# Altium project WR_NIC.PrjPcb (part 3 of 3)

## Sheet 18-Power-P3V3.SchDoc
size B; SheetNumber: 18; SheetTotal: 20; SPICEModelCacheMBQUAUON: <root> / <DocumentId>MBQUAUON</DocumentId> / <CacheFrame Number="0"> / <Model Name="emk105bj105_v-f" Kind="CKT"> / <Text>* EMK105BJ105_V-F     SPICE MODEL  ( General Type ) / *-------------------------------------------------------------------------------------------------------- / * Model Generated by TAIYO YUDEN Corporation (http://www.ty-top.com) / * Version 1.0 / * TAIYO YUDEN Control No. 170508_130520 / * Copyright(c) 2012 TAIYO YUDEN CO.,LTD. All Rights Reserved. / *-------------------------------------------------------------------------------------------------------- / * / * Products Name : Multilayer Ceramic Capacitors / * / * Characteristics : / *     Capacitance : 1 uF , Rated Voltage : 16V , TCC : X5R / *     Case Size : 1.0 x 0.5 / 0.039 x 0.02 [mm/inch] , Thickness : 0.5 / 0.02 [mm/inch] / *     (Conditions: Temperature = 25 degC , DC Bias Current/Voltage = 0A / 0V) / * / * Frequency Range : 40Hz - 3GHz / * / * External Node Assignments : / * / *  1  o---| |---o  2 / * / *-------------------------------------------------------------------------------------------------------- / .SubCkt EMK105BJ105_V-F 1 2 / **************************** / C0 1 110 0.68309u / Cm 1 101 0.26053u / C1 101 102 0.94076u / Rc1 101 102 1.9029k / C2 102 103 0.66707u / Rc2 102 103 120.36 / C3 103 110 0.57203u / Rc3 103 110 2.1097 / C2m 1 301 0.1871u / C21 301 302 3.2494u / Rc21 301 302 1.1117k / C22 302 303 2.1014u / Rc22 302 303 1.484k / C23 303 304 2.1172u / Rc23 303 304 1.3876k / C24 304 305 0.75729u / Rc24 304 305 332.59 / C25 305 306 0.94401u / Rc25 305 306 249.09 / C26 306 307 0.34674u / Rc26 306 307 28.352 / C27 307 308 0.37158u / Rc27 307 308 19.989 / C28 308 309 0.17933u / Rc28 308 309 31.748 / C29 309 110 0.016445u / Rc29 309 110 1.0592 / Rp0 1 110 100Meg / L0 110 120 0.2216n / Lm 120 130 0.1509n / L1 120 121 0.12659n / RL1 121 130 0.85161 / L2 120 122 0.15996n / RL2 122 130 0.42469 / L3 120 123 7.9543n / RL3 123 130 0.54643m / CR 120 124 0.24334u / LR 124 125 0.090738n / RR 125 130 68.076m / CL 130 140 2.7354p / LL 130 140 0.10762n / RL 130 140 50.614 / Rs 140 2 7.5416m / **************************** / .ends EMK105BJ105_V-F</Text> / </Model> / </CacheFrame> / </root>
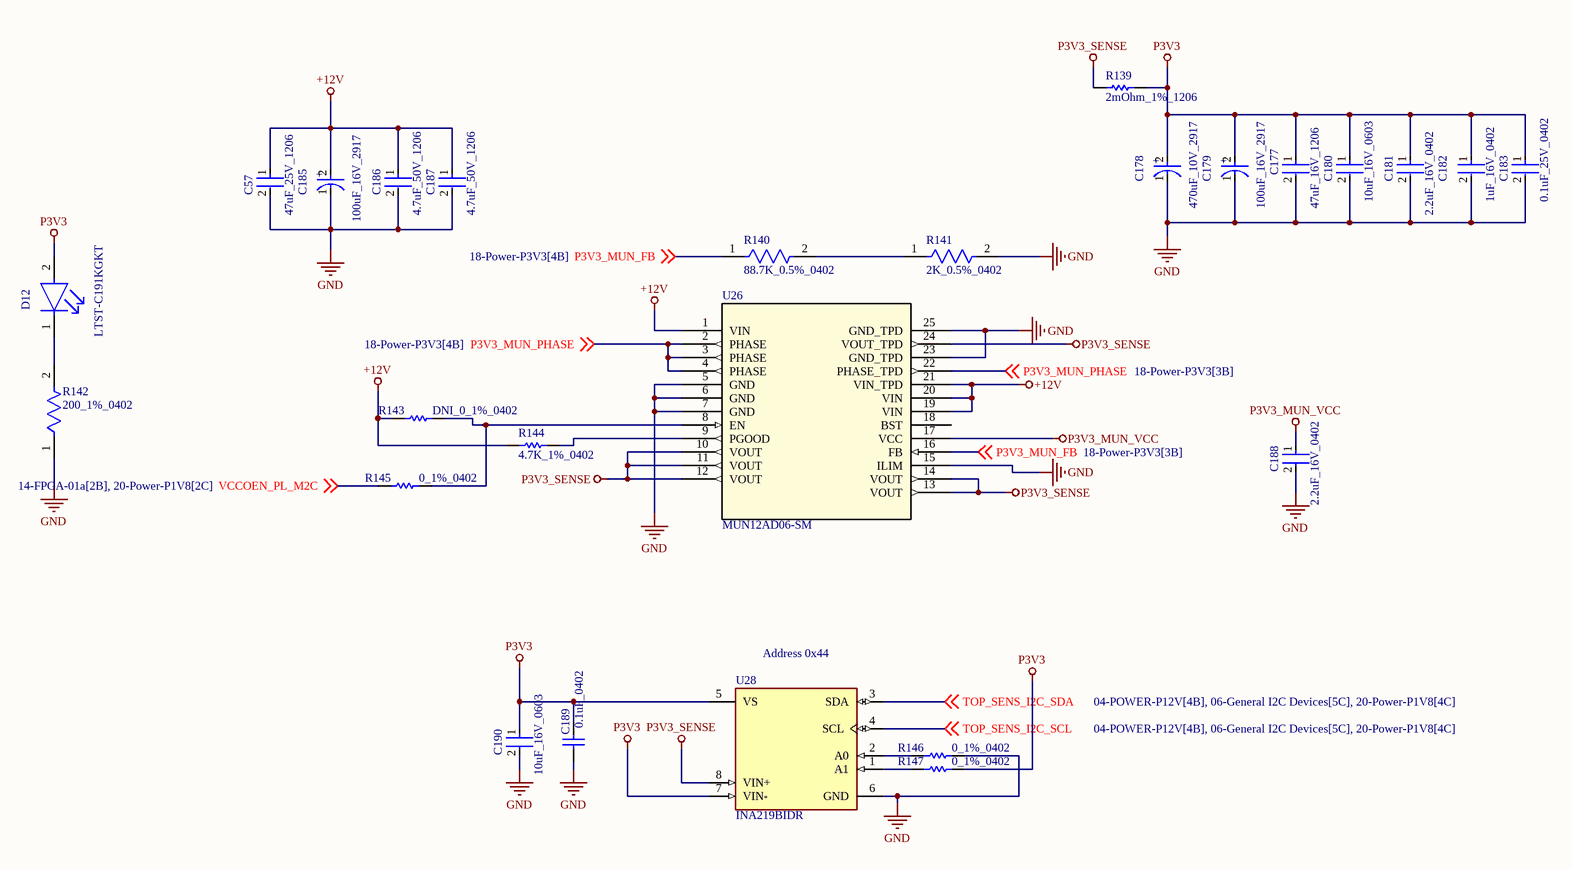
[diagram p9: 18-Power-P3V3.SchDoc]

### Parts
C57  47uF_25V_1206  [FP-C3216-160-0_2-MFG]
C177  47uF_16V_1206  [FP-C3216-160-0_2-MFG]
C178  470uF_10V_2917  [FP-TAJE-MFG]
C179  100uF_16V_2917  [FP-T495D107K016ATE125-MFG]
C180  10uF_16V_0603  [FP-0603-L_1_6_0_2-W_0_8_0-MFG]
C181  2.2uF_16V_0402  [FP-C1005-050-0_05-IPC_A]
C182  1uF_16V_0402  [FP-0402-L_1_0_0_05-W_0_5-IPC_A]
C183  0.1uF_25V_0402  [FP-0402-L_1_0_1-W_0_5_0_1-IPC_C]
C185  100uF_16V_2917  [FP-T495D107K016ATE125-MFG]
C186  4.7uF_50V_1206  [FP-GRM31C-0_2-e0_3_0_8-IPC_C]
C187  4.7uF_50V_1206  [FP-GRM31C-0_2-e0_3_0_8-IPC_C]
C188  2.2uF_16V_0402  [FP-C1005-050-0_05-IPC_A]
C189  0.1uF_0402  [CAPC1005X56X25NL10T15]
C190  10uF_16V_0603  [FP-0603-L_1_6_0_2-W_0_8_0-MFG]
D12  LTST-C191KGKT  [FP-LTST-C191KGKT-MFG]
R139  2mOhm_1%_1206  [RESC3216X89X64NL25T25]
R140  88.7K_0.5%_0402  [FP-RT0402-MFG]
R141  2K_0.5%_0402  [FP-RR0510-IPC_B]
R142  200_1%_0402  [FP-ERJ2RK-IPC_A]
R143  DNI_0_1%_0402  [RESC1005X40X25LL05T05]  (no BOM)
R144  4.7K_1%_0402  [RESC1005X40X25NL10T10]
R145  0_1%_0402  [RESC1005X40X25LL05T05]
R146  0_1%_0402  [RESC1005X40X25LL05T05]
R147  0_1%_0402  [RESC1005X40X25LL05T05]
U26  MUN12AD06-SM  [MUN12AD06-SM_CYN]
U28  INA219BIDR  [FP-D0008A-MFG]

### Nets
+12V: C57.1 C185.2(A) C186.1 C187.1 R143.1 R144.2 U26.1(VIN) U26.19(VIN) U26.20(VIN) U26.21(VIN_TPD)
GND: C57.2 C177.2 C178.1(C) C179.1(C) C180.2 C181.2 C182.2 C183.2 C185.1(C) C186.2 C187.2 C188.2 C189.1 C190.2 R141.2 R142.1 R146.2 U26.5(GND) U26.6(GND) U26.7(GND) U26.15(ILIM) U26.23(GND_TPD) U26.25(GND_TPD) U28.6(GND)
P3V3: C177.1 C178.2(A) C179.2(A) C180.1 C181.1 C182.1 C183.1 C189.2 C190.1 D12.2(A) R139.2 R147.2 U28.5(VS) U28.7(VIN-)
P3V3_MUN_VCC: C188.1 U26.17(VCC)
P3V3_SENSE: R139.1 U26.10(VOUT) U26.11(VOUT) U26.12(VOUT) U26.13(VOUT) U26.14(VOUT) U26.24(VOUT_TPD) U28.8(VIN+)
P3V3_MUN_FB: R140.1 U26.16(FB) ; off-sheet P3V3_MUN_FB
P3V3_MUN_PHASE: U26.2(PHASE) U26.3(PHASE) U26.4(PHASE) U26.22(PHASE_TPD) ; off-sheet P3V3_MUN_PHASE
TOP_SENS_I2C_SCL: U28.4(SCL) ; off-sheet TOP_SENS_I2C_SCL
TOP_SENS_I2C_SDA: U28.3(SDA) ; off-sheet TOP_SENS_I2C_SDA
VCCOEN_PL_M2C: R145.1 ; off-sheet VCCOEN_PL_M2C
NetD12_1: D12.1(C) R142.2
NetR140_2: R140.2 R141.1
NetR143_2: R143.2 R145.2 U26.8(EN)
NetR144_1: R144.1 U26.9(PGOOD)
NetR146_1: R146.1 U28.2(A0)
NetR147_1: R147.1 U28.1(A1)

Not connected (* = marked no-connect by the designer): U26 18(BST)

### Notes on the sheet
- (near U28) Address 0x44
- (in symbol CMP-2000-07207-2) +
- (in symbol CMP-04424-000243-1) +

### Library data of the parts
C57 = CMP-2000-05397-3: Multilayer Ceramic Capacitors 47uF ±20% 25V X5R SMD 1206; Weight: 0.000571oz; Dielectric: X5R; Length: 0.126inch; Voltage Rating: 25V; Case/Package: 1206; Dielectric Material: Ceramic; Min Operating Temperature: -55°C; Lead Free: Lead Free; Packaging: Tape and Reel; Package Quantity: 1; Mount: Surface Mount; Depth: 1.6mm; REACH SVHC: No SVHC; Termination: SMD/SMT; Case Code (Imperial): 1206; Series: C; Resistor Type: Ceramic; Voltage: 25V; Width: 0.063inch; Height: 1.6mm; Tolerance: 20%; Capacitance: 47uF; Max Operating Temperature: 85°C; Voltage Rating (DC): 25V; RoHS Compliant: Yes; Thickness: 0.071inch; Case Code (Metric): 3216
C177 = CMP-2000-07442-2: Multilayer Ceramic Capacitors 47uF ±20% 16V X5R SMD 1206; Resistor Type: Ceramic; Width: 0.063inch; Case Code (Imperial): 1206; Radiation Hardening: No; Thickness: 0.071inch; Dielectric: X5R; Weight: 0.000571oz; Termination: SMD/SMT; Dielectric Material: Ceramic; Min Operating Temperature: -55°C; Depth: 1.6mm; Case Code (Metric): 3216; Max Operating Temperature: 85°C; RoHS Compliant: Yes; REACH SVHC: No SVHC; Mount: Surface Mount; Lead Free: Lead Free; Height: 1.6mm; Length: 3.2mm; Tolerance: 20%; Voltage Rating (DC): 16V; Capacitance: 47uF; Package Quantity: 1; Construction: Flat; Packaging: Tape and Reel; Series: C; Case/Package: 1206; Voltage Rating: 16V
C178 = CMP-04424-000243-1: 470uF 10V  ±10% 500mΩ 2917  SMD Tantalum Capacitor; Leakage Current: 47uA; ESR (Equivalent Series Resistance): 500mR; Polarity: Polar; Construction: Flat; Width: 4.3mm; Mount: Surface Mount; Tolerance: 10%; Max Operating Temperature: 125°C; Min Operating Temperature: -55°C; Length: 7.3mm; Voltage: 10V; Dissipation Factor: 10%; REACH SVHC: No SVHC; Lead Free: Lead Free; Case/Package: 2917; Voltage Rating: 10V; Capacitance: 470uF; Series: TAJ; Height: 4.1mm; RoHS Compliant: Yes; Packaging: Tape and Reel; Voltage Rating (DC): 10V; Radiation Hardening: No; Dielectric Material: Tantalum; Number of Pins: 2; Depth: 4.3mm; Case Code (Metric): 7343; Case Code (Imperial): 2917; Termination: SMD/SMT; Lead Pitch: 4.4mm; Features: General Purpose; Height - Seated (Max): 0.169inch; Package Quantity: 1
C179 C185 = CMP-2000-07207-2: CAP TANT 100UF 10% 16V 2917; Life (Hours): 2000Hour; ESR (Equivalent Series Resistance): 125mR; Polarity: Polar; Dielectric Material: Tantalum; Dissipation Factor: 8%; Capacitance: 100uF; Radiation Hardening: No; RoHS Compliant: Yes; Length: 7.3mm; Features: General Purpose; Packaging: Tape and Reel; Package Quantity: 1; Weight: 0.023634oz; Voltage Rating: 16V; Width: 0.169inch; Case/Package: 2917; Mount: Surface Mount; Voltage: 16V; Min Operating Temperature: -55°C; Tolerance: 10%; REACH SVHC: No SVHC; Height - Seated (Max): 0.122inch; Number of Pins: 2; Construction: Flat; Depth: 4.3mm; Series: T495; Max Operating Temperature: 125°C; Failure Rate: 0.001%; Termination: SMD/SMT; Voltage Rating (DC): 16V; Case Code (Imperial): 2917; Case Code (Metric): 7343; Height: 2.8mm
C180 C190 = CMP-2000-06226-4: Multilayer Ceramic Capacitor 10uF 16V X5R 20% SMD 0603 T/R; Packaging: Tape and Reel; Construction: Flat; Height: 0.8mm; Max Operating Temperature: 85°C; Dielectric: X5R; Case Code (Metric): 1608; Voltage Rating (DC): 16V; Width: 0.031inch; Voltage Rating: 16V; Length: 0.063inch; RoHS Compliant: Yes; Halogen Free: Halogen Free; Case Code (Imperial): 0603; Capacitance: 10uF; Mount: Surface Mount; Thickness: 0.031inch; Tolerance: 20%; Min Operating Temperature: -55°C; Series: M; Termination: SMD/SMT; Case/Package: 0603; Package Quantity: 1
C181 C188 = CMP-2000-05998-2: Multilayer Ceramic Capacitors 2.2μF ±10% 16V X5R SMD 0402; Capacitance: 2.2uF; REACH SVHC: No SVHC; Series: C; Termination: SMD/SMT; Case Code (Imperial): 0402; Depth: 0.5mm; Mount: Surface Mount; Width: 0.02inch; Package Quantity: 1; Dielectric Material: Ceramic; Length: 1mm; Packaging: Tape and Reel; Case Code (Metric): 1005; RoHS Compliant: Yes; Dielectric: X5R; Max Operating Temperature: 85°C; Lead Free: Lead Free; Weight: 2.3E-05oz; Thickness: 0.022inch; Voltage Rating (DC): 16V; Tolerance: 10%; Voltage Rating: 16V; Resistor Type: Ceramic; Height: 0.5mm; Case/Package: 0402; Min Operating Temperature: -55°C
C182 = CMP-14477-000104-2: None; Tolerance: 10%; Voltage Rating: 16V; Dielectric: X5R; Capacitance: 1uF; Packaging: Tape and Reel; Depth: 0.5mm; Mount: Surface Mount; Thickness: 0.022inch; Package Quantity: 1; Min Operating Temperature: -55°C; Series: M; Voltage Rating (DC): 16V; Termination: SMD/SMT; Case/Package: 0402; Number of Pins: 2; Case Code (Imperial): 0402; Length: 1mm; Halogen Free: Halogen Free; Case Code (Metric): 1005; Width: 0.02inch; RoHS Compliant: Yes; Radiation Hardening: No; Max Operating Temperature: 85°C; Height: 0.5mm; Construction: Flat
C183 = CMP-2008-02519-2: General Purpose Ceramic Capacitor, 0402, 100nF, 10%, X7R, 15%, 25V; Package Quantity: 1; Capacitance: 100nF; Min Operating Temperature: -55°C; Voltage: 25V; Voltage Rating: 25V; Construction: Flat; Max Operating Temperature: 125°C; Radiation Hardening: No; Depth: 0.5mm; Thickness: 0.022inch; Voltage Rating (DC): 25V; Number of Pins: 2; Lead Free: Lead Free; Series: -; REACH SVHC: No SVHC; Length: 1mm; Dielectric: X7R; RoHS Compliant: Yes; Mount: Surface Mount; Packaging: Tape and Reel; Case/Package: 0402; Case Code (Imperial): 0402; Termination: SMD/SMT; Width: 0.02inch; Case Code (Metric): 1005; Tolerance: 10%
C186 C187 = CMP-1037-04923-3: Chip Multilayer Ceramic Capacitors for General Purpose, 1206, 4.7uF, X7R, 15%, 10%, 50V; Height: 1.6mm; Voltage: 50V; Capacitance: 4.7uF; Lead Free: Lead Free; Max Operating Temperature: 125°C; Packaging: Tape and Reel; REACH SVHC: No SVHC; Voltage Rating: 50V; Mount: Surface Mount; Termination: SMD/SMT; Tolerance: 10%; Case/Package: 1206; Material: Ceramic; Depth: 1.6mm; Length: 3.2mm; Case Code (Metric): 3216; Voltage Rating (DC): 50V; Case Code (Imperial): 1206; Radiation Hardening: No; Width: 0.063inch; Thickness: 0.071inch; Package Quantity: 2000; Min Operating Temperature: -55°C; Dielectric: X7R
C189 = CMP-2008-00031-1: Part Number: LD02YD104KAB2A; Manufacturer: AVX Interconnect / Elco
D12 = CMP-2000-05198-2: LED GREEN CLEAR SMD; Max Power Dissipation: 75mW; Forward Current: 30mA; Reverse Voltage: 5V; Lens Color: Colorless; Forward Voltage: 2V; Dominant Wavelength: 571nm; Number of LEDs: 1; Viewing Angle: 130°; Lens Style: Rectangular; Test Current: 20mA; Luminous Intensity: 35mcd; Wavelength: 574nm; Width: 0.8mm; Case Code (Imperial): 0603; Number of Pins: 2; Lead Free: Lead Free; Packaging: Tape and Reel; Package Quantity: 1; Min Operating Temperature: -55°C; Case/Package: 0603; Length: 1.6mm; Power Dissipation: 75mW; Depth: 0.8mm; Radiation Hardening: No; Mount: Surface Mount; Max Operating Temperature: 85°C; Color: Green; Power Rating: 75mW; Height: 0.55mm; Illumination Color: Green; Case Code (Metric): 1608; Lens Transparency: Clear; Number of Elements: 1
R139 = CMP-2003-04334-1: Manufacturer: Vishay Dale; Part Number: WSL12062L000FEA18
R140 = CMP-2002-03021-2: RES SMD 88.7K OHM 0.5% 1/16W; Manufacturer: Yageo; Manufacturer Part Number: RT0402DRE0788K7L; Voltage Rating: 50V; Power Rating: 0.063W; Value: 88.7KΩ; Temperature Coefficient: 50 ppm/°C; Tolerance: 0.005; Temperature Range High: +155°C; Composition: Thin Film; ComponentLink2Description: Datasheet; RoHS: TRUE; Category: Res; Ipc Land Pattern Name: RESC10050X30; Octopart: https://octopart.com/rt0402dre0788k7l-yageo-1439224; ComponentLink2URL: http://www.yageo.com/documents/recent/PYu-RT_1-to-0.01_RoHS_L_9.pdf; Digikey Description: RES SMD 88.7K OHM 0.5% 1/16W; Height: 0.35mm; Series: RT; Footprint Url: http://www.yageo.com/exep/pages/download/literatures/PYu-R_Mount_10.pdf; Device Class L2: Resistors; Temperature: -55°C to +155°C; Temperature Range Low: -55°C; Package: RT0402; Device Class L1: Passive Components; Automotive: No; Lead Free: Yes; Device Class L3: Chip SMD Resistors; Resistance: 88.7KΩ
R141 = CMP-2002-01564-2: 2kΩ ±0.5% 0.0625W 1/16W Chip Resistor 0402 (1005 Metric) Thin Film; Voltage Rating (DC): 50V; Max Power Dissipation: 63mW; Voltage Rating: 25V; Temperature Coefficient: 25ppm/°C; Power Rating: 62.5mW; Resistance: 2kR; Number of Terminations: 2; Lead Free: Lead Free; Packaging: Tape and Reel; Case Code (Metric): 1005; Length: 0.039inch; Height: 0.016inch; Size Code: 0402; Case Code (Imperial): 0402; Width: 0.5mm; Tolerance: 0.5%; Max Operating Temperature: 125°C; RoHS Compliant: Yes; Case/Package: 0402; Min Operating Temperature: -55°C; Series: RR; Resistor Type: Thin Film; Termination: SMD/SMT; Package Quantity: 1
R142 = CMP-2002-00757-2: RES SMD 200 OHM 1% 1/10W 0402; Power Rating: 100mW; Voltage Rating (DC): 50V; Resistance: 200R; Temperature Coefficient: 100ppm/°C; RoHS Compliant: Yes; Packaging: Tape and Reel; Case Code (Metric): 1005; Package Quantity: 1; Contact Plating: Tin; Series: ERJ; Mount: Surface Mount; Lead Free: Lead Free; Min Operating Temperature: -55°C; Number of Terminations: 2; Max Power Dissipation: 100mW; Technology: THICK FILM; Voltage Rating: 50V; Case/Package: 0402; Width: 0.02inch; Termination: SMD/SMT; Military Standard: Not; Height: 0.35mm; Radiation Hardening: No; Resistance Tolerance: 1%; Length: 1mm; REACH SVHC: No SVHC; Construction: Rectangular; Depth: 0.5mm; Features: Automotive AEC-Q200; Resistor Type: Thick Film; Case Code (Imperial): 0402; Tolerance: 1%; Size Code: 0402; Max Operating Temperature: 155°C
R143 R145-R147 = CMP-2000-07451-1: Chip Resistor, 0 Ohm, 0.1 W, -55 to 155 degC, 0402 (1005 Metric), RoHS, Tape and Reel; Manufacturer: Panasonic; Voltage Rating (DC): 50V; Temperature Coefficient: 600ppm/��C; Max Power Dissipation: 100mW; Resistance: 0mOhm; Tolerance: 5%; Number of Terminations: 2; Mount: SurfaceMount; Height: 0.35mm; Packaging: TapeandReel; Contact Plating: Tin; Manufacturer URL: http://www.panasonic.com/; Composition: ThickFilm; Max Operating Temperature: 155degC; REACH SVHC: NoSVHC; Case/Package: 0402; Package Reference: 402; Depth: 0.5mm; Package Description: 2-Pin Surface Mount Device, Body 1 x 0.5 mm; Datasheet URL: https://industrial.panasonic.com/cdbs/www-data/pdf/RDA0000/AOA0000C301.pdf; RoHSCompliant: True; Case Code (Imperial): 0402; Military Standard: Not; Min Operating Temperature: -55degC; Power Rating: 100mW; Datasheet Version: 03/2015; Length: 1mm; Case Code (Metric): 1005; Termination: SMD/SMT; Mounting Technology: SurfaceMount; Voltage Rating: 50V; Width: 0.02inch; Package Quantity: 1; Lead Free: LeadFree; Radiation Hardening: No
R144 = CMP-2002-05217-1: Manufacturer: Bourns; Part Number: CR0402-FX-4701GLF
U26 = MUN12AD06-SM: No Description Available; Mfr_Name: Cyntec; RefDes: RefDes; Type: Type
U28 = CMP-0704-00005-3: IC MONITOR PWR/CURR BIDIR 8-SOIC; Min Supply Voltage: 3V; Common Mode Rejection Ratio: 100dB; Output Current: 10mA; Number of Amplifiers: 1; Accuracy: 0.5%; Supply Current: 1mA; Quiescent Current: 700uA; Bandwidth: 11kHz; Input Offset Voltage (Vos): 40uV; Max Supply Voltage: 5.5V; Packaging: Tape and Reel; REACH SVHC: No SVHC; Max Operating Temperature: 125°C; Number of Pins: 8; Lead Free: Lead Free; Package Quantity: 1; Radiation Hardening: No; Case/Package: SOIC; Min Operating Temperature: -40°C; Contact Plating: Gold; Series: Zero-Drift; Nominal Supply Current: 1mA; RoHS Compliant: Yes

## Sheet 19-Power-P5V.SchDoc
size B; SheetNumber: 19; SheetTotal: 20; SPICEModelCacheMWNZRPGN: <root> / <DocumentId>MWNZRPGN</DocumentId> / <CacheFrame Number="0"> / <Model Name="emk105bj105_v-f" Kind="CKT"> / <Text>* EMK105BJ105_V-F     SPICE MODEL  ( General Type ) / *-------------------------------------------------------------------------------------------------------- / * Model Generated by TAIYO YUDEN Corporation (http://www.ty-top.com) / * Version 1.0 / * TAIYO YUDEN Control No. 170508_130520 / * Copyright(c) 2012 TAIYO YUDEN CO.,LTD. All Rights Reserved. / *-------------------------------------------------------------------------------------------------------- / * / * Products Name : Multilayer Ceramic Capacitors / * / * Characteristics : / *     Capacitance : 1 uF , Rated Voltage : 16V , TCC : X5R / *     Case Size : 1.0 x 0.5 / 0.039 x 0.02 [mm/inch] , Thickness : 0.5 / 0.02 [mm/inch] / *     (Conditions: Temperature = 25 degC , DC Bias Current/Voltage = 0A / 0V) / * / * Frequency Range : 40Hz - 3GHz / * / * External Node Assignments : / * / *  1  o---| |---o  2 / * / *-------------------------------------------------------------------------------------------------------- / .SubCkt EMK105BJ105_V-F 1 2 / **************************** / C0 1 110 0.68309u / Cm 1 101 0.26053u / C1 101 102 0.94076u / Rc1 101 102 1.9029k / C2 102 103 0.66707u / Rc2 102 103 120.36 / C3 103 110 0.57203u / Rc3 103 110 2.1097 / C2m 1 301 0.1871u / C21 301 302 3.2494u / Rc21 301 302 1.1117k / C22 302 303 2.1014u / Rc22 302 303 1.484k / C23 303 304 2.1172u / Rc23 303 304 1.3876k / C24 304 305 0.75729u / Rc24 304 305 332.59 / C25 305 306 0.94401u / Rc25 305 306 249.09 / C26 306 307 0.34674u / Rc26 306 307 28.352 / C27 307 308 0.37158u / Rc27 307 308 19.989 / C28 308 309 0.17933u / Rc28 308 309 31.748 / C29 309 110 0.016445u / Rc29 309 110 1.0592 / Rp0 1 110 100Meg / L0 110 120 0.2216n / Lm 120 130 0.1509n / L1 120 121 0.12659n / RL1 121 130 0.85161 / L2 120 122 0.15996n / RL2 122 130 0.42469 / L3 120 123 7.9543n / RL3 123 130 0.54643m / CR 120 124 0.24334u / LR 124 125 0.090738n / RR 125 130 68.076m / CL 130 140 2.7354p / LL 130 140 0.10762n / RL 130 140 50.614 / Rs 140 2 7.5416m / **************************** / .ends EMK105BJ105_V-F</Text> / </Model> / </CacheFrame> / </root>
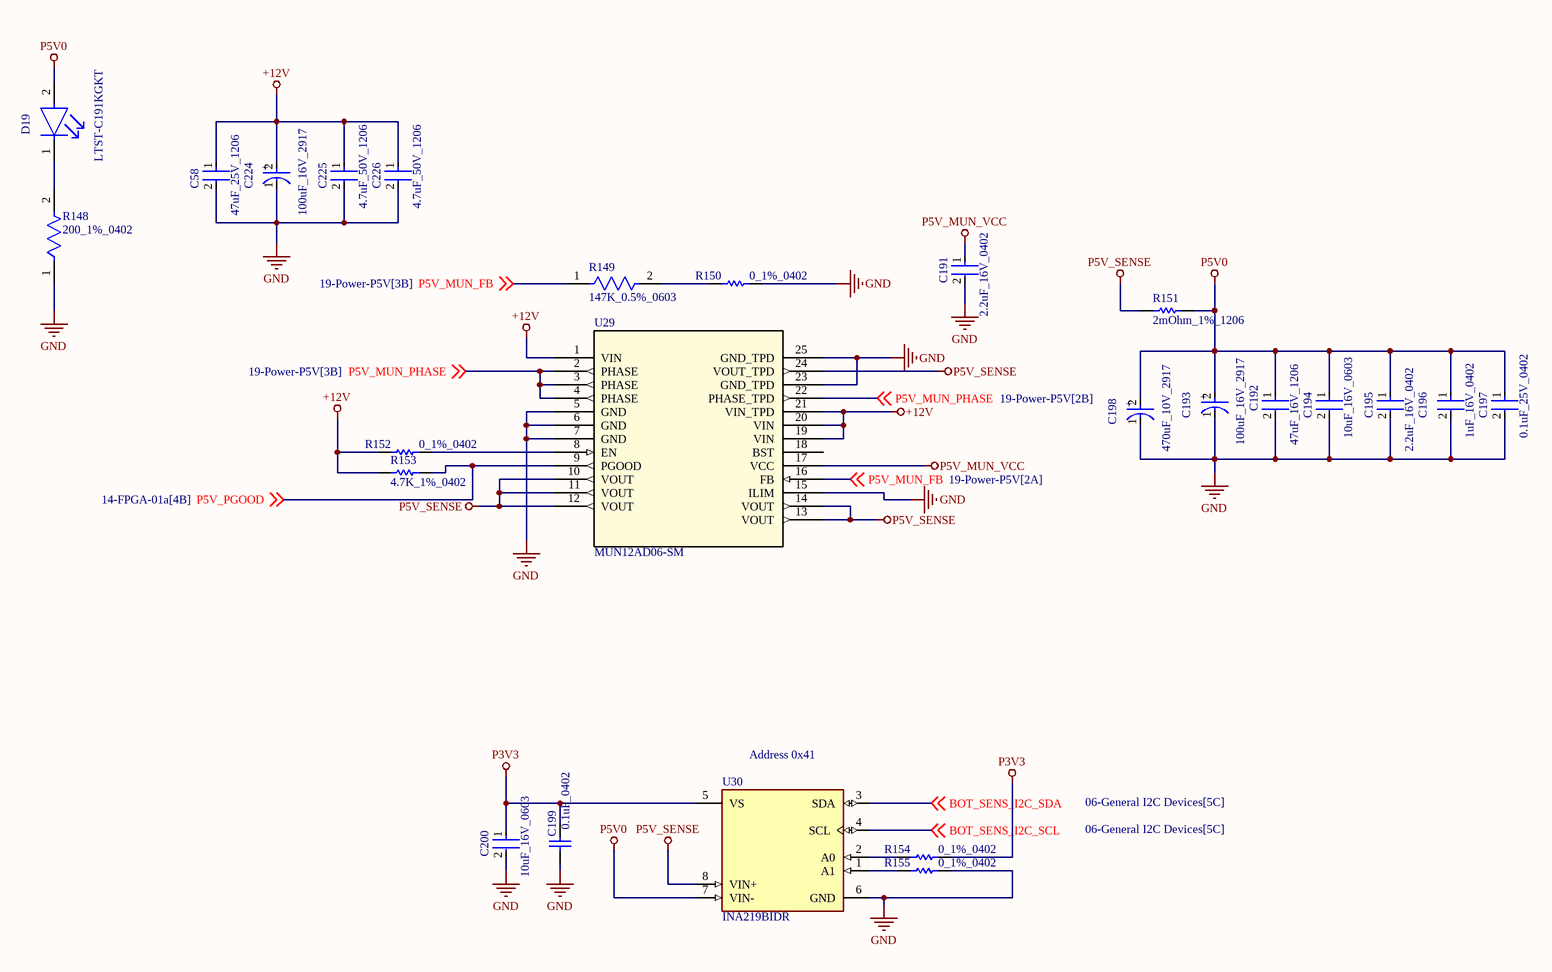
[diagram p10: 19-Power-P5V.SchDoc]

### Parts
C58  47uF_25V_1206  [FP-C3216-160-0_2-MFG]
C191  2.2uF_16V_0402  [FP-C1005-050-0_05-IPC_A]
C192  47uF_16V_1206  [FP-C3216-160-0_2-MFG]
C193  100uF_16V_2917  [FP-T495D107K016ATE125-MFG]
C194  10uF_16V_0603  [FP-0603-L_1_6_0_2-W_0_8_0-MFG]
C195  2.2uF_16V_0402  [FP-C1005-050-0_05-IPC_A]
C196  1uF_16V_0402  [FP-0402-L_1_0_0_05-W_0_5-IPC_A]
C197  0.1uF_25V_0402  [FP-0402-L_1_0_1-W_0_5_0_1-IPC_C]
C198  470uF_10V_2917  [FP-TAJE-MFG]
C199  0.1uF_0402  [CAPC1005X56X25NL10T15]
C200  10uF_16V_0603  [FP-0603-L_1_6_0_2-W_0_8_0-MFG]
C224  100uF_16V_2917  [FP-T495D107K016ATE125-MFG]
C225  4.7uF_50V_1206  [FP-GRM31C-0_2-e0_3_0_8-IPC_C]
C226  4.7uF_50V_1206  [FP-GRM31C-0_2-e0_3_0_8-IPC_C]
D19  LTST-C191KGKT  [FP-LTST-C191KGKT-MFG]
R148  200_1%_0402  [FP-ERJ2RK-IPC_A]
R149  147K_0.5%_0603  [FP-RR0816-IPC_C]
R150  0_1%_0402  [RESC1005X40X25LL05T05]
R151  2mOhm_1%_1206  [RESC3216X89X64NL25T25]
R152  0_1%_0402  [RESC1005X40X25LL05T05]
R153  4.7K_1%_0402  [RESC1005X40X25NL10T10]
R154  0_1%_0402  [RESC1005X40X25LL05T05]
R155  0_1%_0402  [RESC1005X40X25LL05T05]
U29  MUN12AD06-SM  [MUN12AD06-SM_CYN]
U30  INA219BIDR  [FP-D0008A-MFG]

### Nets
+12V: C58.1 C224.2(A) C225.1 C226.1 R152.1 R153.2 U29.1(VIN) U29.19(VIN) U29.20(VIN) U29.21(VIN_TPD)
GND: C58.2 C191.2 C192.2 C193.1(C) C194.2 C195.2 C196.2 C197.2 C198.1(C) C199.1 C200.2 C224.1(C) C225.2 C226.2 R148.1 R150.2 R155.2 U29.5(GND) U29.6(GND) U29.7(GND) U29.15(ILIM) U29.23(GND_TPD) U29.25(GND_TPD) U30.6(GND)
P3V3: C199.2 C200.1 R154.2 U30.5(VS)
P5V0: C192.1 C193.2(A) C194.1 C195.1 C196.1 C197.1 C198.2(A) D19.2(A) R151.2 U30.7(VIN-)
P5V_MUN_VCC: C191.1 U29.17(VCC)
P5V_SENSE: R151.1 U29.10(VOUT) U29.11(VOUT) U29.12(VOUT) U29.13(VOUT) U29.14(VOUT) U29.24(VOUT_TPD) U30.8(VIN+)
BOT_SENS_I2C_SCL: U30.4(SCL) ; off-sheet BOT_SENS_I2C_SCL
BOT_SENS_I2C_SDA: U30.3(SDA) ; off-sheet BOT_SENS_I2C_SDA
P5V_MUN_FB: R149.1 U29.16(FB) ; off-sheet P5V_MUN_FB
P5V_MUN_PHASE: U29.2(PHASE) U29.3(PHASE) U29.4(PHASE) U29.22(PHASE_TPD) ; off-sheet P5V_MUN_PHASE
P5V_PGOOD: R153.1 U29.9(PGOOD) ; off-sheet P5V_PGOOD
NetD19_1: D19.1(C) R148.2
NetR149_2: R149.2 R150.1
NetR152_2: R152.2 U29.8(EN)
NetR154_1: R154.1 U30.2(A0)
NetR155_1: R155.1 U30.1(A1)

Not connected (* = marked no-connect by the designer): U29 18(BST)

### Notes on the sheet
- (near U30) Address 0x41
- (in symbol CMP-2000-07207-2) +
- (in symbol CMP-04424-000243-1) +

### Library data of the parts
C58 = CMP-2000-05397-3: as C57 on sheet 18-Power-P3V3; Weight: 0.000571oz; Dielectric: X5R; Length: 0.126inch; Voltage Rating: 25V; Case/Package: 1206; Dielectric Material: Ceramic; Min Operating Temperature: -55°C; Lead Free: Lead Free; Packaging: Tape and Reel; Package Quantity: 1; Mount: Surface Mount; Depth: 1.6mm; REACH SVHC: No SVHC; Termination: SMD/SMT; Case Code (Imperial): 1206; Series: C; Resistor Type: Ceramic; Voltage: 25V; Width: 0.063inch; Height: 1.6mm; Tolerance: 20%; Capacitance: 47uF; Max Operating Temperature: 85°C; Voltage Rating (DC): 25V; RoHS Compliant: Yes; Thickness: 0.071inch; Case Code (Metric): 3216
C191 C195 = CMP-2000-05998-2: as C181 on sheet 18-Power-P3V3; REACH SVHC: No SVHC; Series: C; Termination: SMD/SMT; Case Code (Imperial): 0402; Depth: 0.5mm; Mount: Surface Mount; Width: 0.02inch; Package Quantity: 1; Dielectric Material: Ceramic; Length: 1mm; Packaging: Tape and Reel; Case Code (Metric): 1005; RoHS Compliant: Yes; Dielectric: X5R; Max Operating Temperature: 85°C; Lead Free: Lead Free; Weight: 2.3E-05oz; Thickness: 0.022inch; Voltage Rating (DC): 16V; Tolerance: 10%; Voltage Rating: 16V; Resistor Type: Ceramic; Height: 0.5mm; Case/Package: 0402; Min Operating Temperature: -55°C
C192 = CMP-2000-07442-2: as C177 on sheet 18-Power-P3V3; Resistor Type: Ceramic; Width: 0.063inch; Case Code (Imperial): 1206; Radiation Hardening: No; Thickness: 0.071inch; Dielectric: X5R; Weight: 0.000571oz; Termination: SMD/SMT; Dielectric Material: Ceramic; Min Operating Temperature: -55°C; Depth: 1.6mm; Case Code (Metric): 3216; Max Operating Temperature: 85°C; RoHS Compliant: Yes; REACH SVHC: No SVHC; Mount: Surface Mount; Lead Free: Lead Free; Height: 1.6mm; Length: 3.2mm; Tolerance: 20%; Voltage Rating (DC): 16V; Capacitance: 47uF; Package Quantity: 1; Construction: Flat; Packaging: Tape and Reel; Series: C; Case/Package: 1206; Voltage Rating: 16V
C193 C224 = CMP-2000-07207-2: as C179 on sheet 18-Power-P3V3; Capacitance: 100uF; Radiation Hardening: No; RoHS Compliant: Yes; Length: 7.3mm; Features: General Purpose; Packaging: Tape and Reel; Package Quantity: 1; Weight: 0.023634oz; Voltage Rating: 16V; Width: 0.169inch; Case/Package: 2917; Mount: Surface Mount; Voltage: 16V; Min Operating Temperature: -55°C; Tolerance: 10%; REACH SVHC: No SVHC; Height - Seated (Max): 0.122inch; Number of Pins: 2; Construction: Flat; Depth: 4.3mm; Series: T495; Max Operating Temperature: 125°C; Failure Rate: 0.001%; Termination: SMD/SMT; Voltage Rating (DC): 16V; Case Code (Imperial): 2917; Case Code (Metric): 7343; Height: 2.8mm
C194 C200 = CMP-2000-06226-4: as C180 on sheet 18-Power-P3V3; Packaging: Tape and Reel; Construction: Flat; Height: 0.8mm; Max Operating Temperature: 85°C; Dielectric: X5R; Case Code (Metric): 1608; Voltage Rating (DC): 16V; Width: 0.031inch; Voltage Rating: 16V; Length: 0.063inch; RoHS Compliant: Yes; Halogen Free: Halogen Free; Case Code (Imperial): 0603; Capacitance: 10uF; Mount: Surface Mount; Thickness: 0.031inch; Tolerance: 20%; Min Operating Temperature: -55°C; Series: M; Termination: SMD/SMT; Case/Package: 0603; Package Quantity: 1
C196 = CMP-14477-000104-2: as C182 on sheet 18-Power-P3V3; Packaging: Tape and Reel; Depth: 0.5mm; Mount: Surface Mount; Thickness: 0.022inch; Package Quantity: 1; Min Operating Temperature: -55°C; Series: M; Voltage Rating (DC): 16V; Termination: SMD/SMT; Case/Package: 0402; Number of Pins: 2; Case Code (Imperial): 0402; Length: 1mm; Halogen Free: Halogen Free; Case Code (Metric): 1005; Width: 0.02inch; RoHS Compliant: Yes; Radiation Hardening: No; Max Operating Temperature: 85°C; Height: 0.5mm; Construction: Flat
C197 = CMP-2008-02519-2: as C183 on sheet 18-Power-P3V3; Package Quantity: 1; Capacitance: 100nF; Min Operating Temperature: -55°C; Voltage: 25V; Voltage Rating: 25V; Construction: Flat; Max Operating Temperature: 125°C; Radiation Hardening: No; Depth: 0.5mm; Thickness: 0.022inch; Voltage Rating (DC): 25V; Number of Pins: 2; Lead Free: Lead Free; Series: -; REACH SVHC: No SVHC; Length: 1mm; Dielectric: X7R; RoHS Compliant: Yes; Mount: Surface Mount; Packaging: Tape and Reel; Case/Package: 0402; Case Code (Imperial): 0402; Termination: SMD/SMT; Width: 0.02inch; Case Code (Metric): 1005; Tolerance: 10%
C198 = CMP-04424-000243-1: as C178 on sheet 18-Power-P3V3; Construction: Flat; Width: 4.3mm; Mount: Surface Mount; Tolerance: 10%; Max Operating Temperature: 125°C; Min Operating Temperature: -55°C; Length: 7.3mm; Voltage: 10V; Dissipation Factor: 10%; REACH SVHC: No SVHC; Lead Free: Lead Free; Case/Package: 2917; Voltage Rating: 10V; Capacitance: 470uF; Series: TAJ; Height: 4.1mm; RoHS Compliant: Yes; Packaging: Tape and Reel; Voltage Rating (DC): 10V; Radiation Hardening: No; Dielectric Material: Tantalum; Number of Pins: 2; Depth: 4.3mm; Case Code (Metric): 7343; Case Code (Imperial): 2917; Termination: SMD/SMT; Lead Pitch: 4.4mm; Features: General Purpose; Height - Seated (Max): 0.169inch; Package Quantity: 1
C199 = CMP-2008-00031-1: as C189 on sheet 18-Power-P3V3
C225 C226 = CMP-1037-04923-3: as C186 on sheet 18-Power-P3V3; Height: 1.6mm; Voltage: 50V; Capacitance: 4.7uF; Lead Free: Lead Free; Max Operating Temperature: 125°C; Packaging: Tape and Reel; REACH SVHC: No SVHC; Voltage Rating: 50V; Mount: Surface Mount; Termination: SMD/SMT; Tolerance: 10%; Case/Package: 1206; Material: Ceramic; Depth: 1.6mm; Length: 3.2mm; Case Code (Metric): 3216; Voltage Rating (DC): 50V; Case Code (Imperial): 1206; Radiation Hardening: No; Width: 0.063inch; Thickness: 0.071inch; Package Quantity: 2000; Min Operating Temperature: -55°C; Dielectric: X7R
D19 = CMP-2000-05198-2: as D12 on sheet 18-Power-P3V3; Width: 0.8mm; Case Code (Imperial): 0603; Number of Pins: 2; Lead Free: Lead Free; Packaging: Tape and Reel; Package Quantity: 1; Min Operating Temperature: -55°C; Case/Package: 0603; Length: 1.6mm; Power Dissipation: 75mW; Depth: 0.8mm; Radiation Hardening: No; Mount: Surface Mount; Max Operating Temperature: 85°C; Color: Green; Power Rating: 75mW; Height: 0.55mm; Illumination Color: Green; Case Code (Metric): 1608; Lens Transparency: Clear; Number of Elements: 1
R148 = CMP-2002-00757-2: as R142 on sheet 18-Power-P3V3; RoHS Compliant: Yes; Packaging: Tape and Reel; Case Code (Metric): 1005; Package Quantity: 1; Contact Plating: Tin; Series: ERJ; Mount: Surface Mount; Lead Free: Lead Free; Min Operating Temperature: -55°C; Number of Terminations: 2; Max Power Dissipation: 100mW; Technology: THICK FILM; Voltage Rating: 50V; Case/Package: 0402; Width: 0.02inch; Termination: SMD/SMT; Military Standard: Not; Height: 0.35mm; Radiation Hardening: No; Resistance Tolerance: 1%; Length: 1mm; REACH SVHC: No SVHC; Construction: Rectangular; Depth: 0.5mm; Features: Automotive AEC-Q200; Resistor Type: Thick Film; Case Code (Imperial): 0402; Tolerance: 1%; Size Code: 0402; Max Operating Temperature: 155°C
R149 = CMP-28537-013021-1: 147kΩ ±0.5% 0.0625W 1/16W Chip Resistor 0603 (1608 Metric) Thin Film; Voltage Rating (DC): 75V; Resistance: 147kR; Power Rating: 62.5mW; Temperature Coefficient: 25ppm/°C; Max Power Dissipation: 63mW; Width: 0.031inch; Termination: SMD/SMT; RoHS Compliant: Yes; Length: 0.063inch; Tolerance: 0.5%; Case Code (Imperial): 0603; Packaging: Tape and Reel; Lead Free: Lead Free; Case/Package: 0603; Weight: 7.1E-05oz; Series: RR; Max Operating Temperature: 125°C; Number of Terminations: 2; Package Quantity: 1; Case Code (Metric): 1608; Resistor Type: Thin Film; Voltage Rating: 75V; Height: 0.02inch; Min Operating Temperature: -55°C
R150 R152 R154 R155 = CMP-2000-07451-1: as R143 on sheet 18-Power-P3V3; Number of Terminations: 2; Mount: SurfaceMount; Height: 0.35mm; Packaging: TapeandReel; Contact Plating: Tin; Manufacturer URL: http://www.panasonic.com/; Composition: ThickFilm; Max Operating Temperature: 155degC; REACH SVHC: NoSVHC; Case/Package: 0402; Package Reference: 402; Depth: 0.5mm; Package Description: 2-Pin Surface Mount Device, Body 1 x 0.5 mm; Datasheet URL: https://industrial.panasonic.com/cdbs/www-data/pdf/RDA0000/AOA0000C301.pdf; RoHSCompliant: True; Case Code (Imperial): 0402; Military Standard: Not; Min Operating Temperature: -55degC; Power Rating: 100mW; Datasheet Version: 03/2015; Length: 1mm; Case Code (Metric): 1005; Termination: SMD/SMT; Mounting Technology: SurfaceMount; Voltage Rating: 50V; Width: 0.02inch; Package Quantity: 1; Lead Free: LeadFree; Radiation Hardening: No
R151 = CMP-2003-04334-1: as R139 on sheet 18-Power-P3V3
R153 = CMP-2002-05217-1: as R144 on sheet 18-Power-P3V3
U29 = MUN12AD06-SM: as U26 on sheet 18-Power-P3V3; RefDes: RefDes; Type: Type
U30 = CMP-0704-00005-3: as U28 on sheet 18-Power-P3V3; Packaging: Tape and Reel; REACH SVHC: No SVHC; Max Operating Temperature: 125°C; Number of Pins: 8; Lead Free: Lead Free; Package Quantity: 1; Radiation Hardening: No; Case/Package: SOIC; Min Operating Temperature: -40°C; Contact Plating: Gold; Series: Zero-Drift; Nominal Supply Current: 1mA; RoHS Compliant: Yes

## Nets that join several sheets
+12V: 18-Power-P3V3 (10 pins), 19-Power-P5V (10 pins)
GND: 02-USER_IO (15 pins), 03-USER_IO_STATUS (10 pins), 07-DPLL-1 (13 pins), 10-JTAG (84 pins), 11-DisplayPort (38 pins), 12-USB Phy and Hub (39 pins), 15-FPGA-01b (55 pins), 17-FPGA-02b (44 pins), 18-Power-P3V3 (24 pins), 19-Power-P5V (24 pins)
P1V8: 10-JTAG (8 pins), 11-DisplayPort (6 pins), 12-USB Phy and Hub (10 pins), 15-FPGA-01b (JA1.D1 JA1.D2), 17-FPGA-02b (JA2.C44 JA2.D42)
P3V3: 02-USER_IO (9 pins), 03-USER_IO_STATUS (14 pins), 07-DPLL-1 (5 pins), 10-JTAG (15 pins), 11-DisplayPort (16 pins), 12-USB Phy and Hub (R27.2 R34.2), 17-FPGA-02b (JA2.D59 JA2.D60), 18-Power-P3V3 (14 pins), 19-Power-P5V (C199.2 C200.1 R154.2 U30.5)
P5V0: 12-USB Phy and Hub (9 pins), 15-FPGA-01b (7 pins), 19-Power-P5V (10 pins)
ANT1_IN: 02-USER_IO (R33.1), 15-FPGA-01b (JA1.D16)
ANT2_IN: 02-USER_IO (R131.1), 17-FPGA-02b (JA2.C56)
ANT2_IO_OUT: 02-USER_IO (R29.2 U12.9), 17-FPGA-02b (JA2.D57)
ANT2_OUT: 02-USER_IO (R130.1), 17-FPGA-02b (JA2.C59)
JTAG_TCK_C2M: 10-JTAG (R74.1), 15-FPGA-01b (R133.2)
LED2: 03-USER_IO_STATUS (R36.1), 17-FPGA-02b (JA2.C47)
MIO27: 11-DisplayPort (U17.8), 15-FPGA-01b (JA1.D29)
MIO28: 11-DisplayPort (U19.9), 15-FPGA-01b (JA1.D30)
MIO29: 11-DisplayPort (U19.8), 15-FPGA-01b (JA1.C30)
MIO30: 11-DisplayPort (U17.9), 15-FPGA-01b (JA1.C31)
MIO52: 12-USB Phy and Hub (U23.1), 15-FPGA-01b (JA1.D36)
MIO53: 12-USB Phy and Hub (U23.31), 15-FPGA-01b (JA1.D37)
MIO54: 12-USB Phy and Hub (U23.5), 15-FPGA-01b (JA1.D38)
MIO55: 12-USB Phy and Hub (U23.2), 15-FPGA-01b (JA1.C38)
MIO56: 12-USB Phy and Hub (U23.3), 15-FPGA-01b (JA1.C39)
MIO57: 12-USB Phy and Hub (U23.4), 15-FPGA-01b (JA1.C40)
PS_POR_B: 10-JTAG (U9.6), 15-FPGA-01b (JA1.C15)
PS_SRST_C2M_B: 10-JTAG (J2.14 U9.4), 15-FPGA-01b (JA1.C16)